# Altium schematic sheet ADF7021 Transceiver.SchDoc: ADF7021 Transceiver
size Letter; SheetNumber: 2; SheetTotal: 11
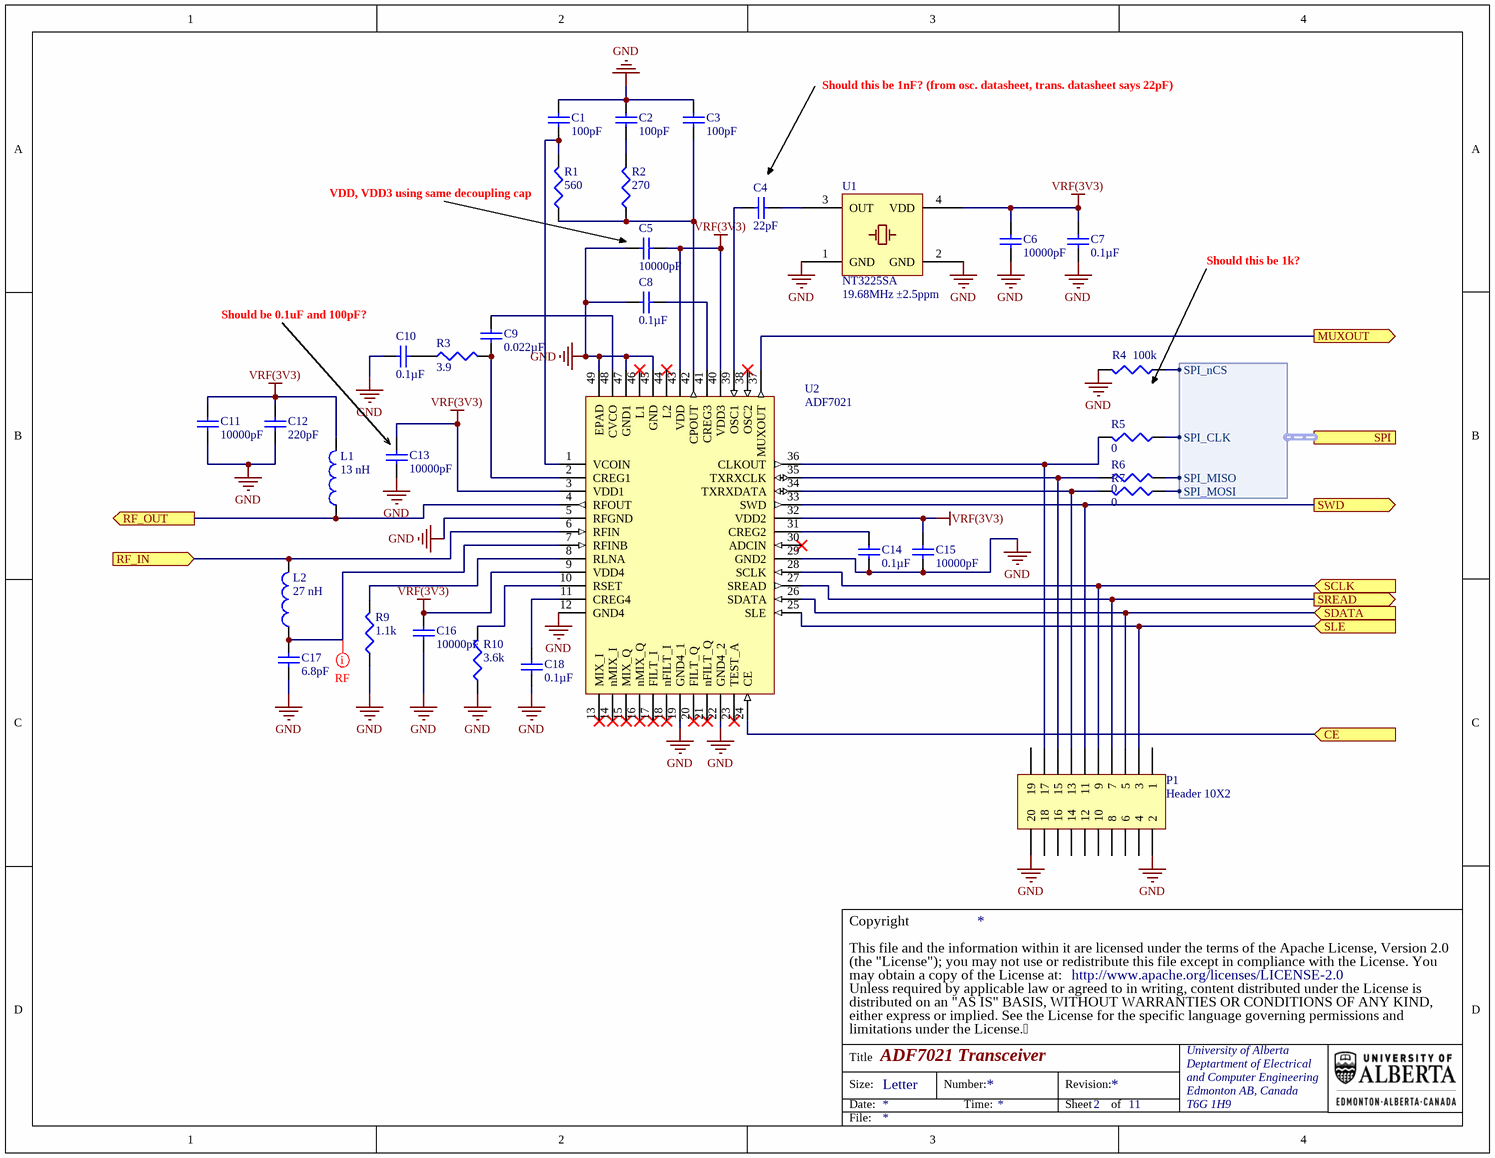
[diagram p0: ADF7021 Transceiver.SchDoc]

## Parts
C1  value 100pF  [TDK-CGA2B]  (hidden comment: Cap)
C2  value 100pF  [TDK-CGA2B]  (hidden comment: Cap)
C3  value 100pF  [TDK-CGA2B]  (hidden comment: Cap)
C4  value 22pF  [ATC-600L]  (hidden comment: Cap)
C5  value 10000pF  [TDK-CGA2B]  (hidden comment: Cap)
C6  value 10000pF  [TDK-CGA2B]  (hidden comment: Cap)
C7  value 0.1µF  [TDK-CGA2B]  (hidden comment: Cap)
C8  value 0.1µF  [TDK-CGA2B]  (hidden comment: Cap)
C9  value 0.022µF  [TDK-CGA2B]  (hidden comment: Cap)
C10  value 0.1µF  [TDK-CGA2B]  (hidden comment: Cap)
C11  value 10000pF  [TDK-CGA2B]  (hidden comment: Cap)
C12  value 220pF  [TDK-CGA2B]  (hidden comment: Cap)
C13  value 10000pF  [TDK-CGA2B]  (hidden comment: Cap)
C14  value 0.1µF  [TDK-CGA2B]  (hidden comment: Cap)
C15  value 10000pF  [TDK-CGA2B]  (hidden comment: Cap)
C16  value 10000pF  [TDK-CGA2B]  (hidden comment: Cap)
C17  value 6.8pF  [ATC-600L]  (hidden comment: Cap)
C18  value 0.1µF  [TDK-CGA2B]  (hidden comment: Cap)
L1  value 13 nH  [CCI-0402CS]  (hidden comment: 0402CS-13NXJLU)
L2  value 27 nH  [CCI-0402CS]  (hidden comment: 0402CS-27NXJLU)
P1  Header 10X2  [MOLX-0555600207]
R1  value 560  [PANA-ERA2A]  (hidden comment: Res3)
R2  value 270  [PANA-ERA2A]  (hidden comment: Res3)
R3  value 3.9  [VSH-CRCW0402]  (hidden comment: Res3)
R4  value 100k  [PANA-ERJ2R]  (hidden comment: Res3)
R5  value 0  [PANA-ERJ2G]  (hidden comment: Jumper)
R6  value 0  [PANA-ERJ2G]  (hidden comment: Jumper)
R7  value 0  [PANA-ERJ2G]  (hidden comment: Jumper)
R9  value 1.1k  [PANA-ERA2A]  (hidden comment: Res3)
R10  value 3.6k  [PANA-ERA2A]  (hidden comment: Res3)
U1  NT3225SA  value 19.68MHz  Frequency Stability: ±2.5ppm  [NDK-NT3225SA]
U2  ADF7021  [ADI-CP-48-5]

## Ports
CE (in), MUXOUT (out), RF_IN (in), RF_OUT (out), SCLK (in), SDATA (in), SLE (in), SPI (harness ADF7021_SPI), SREAD (out), SWD (out)

## Harnesses
ADF7021_SPI: SPI_MOSI, SPI_MISO, SPI_nCS, SPI_CLK

## Nets
GND: C1.2 C2.2 C3.2 C5.1 C6.1 C7.1 C8.2 C10.2 C11.1 C12.1 C13.1 C14.2 C15.1 C16.1 C17.1 C18.2 P1.2 P1.20 R4.2 R9.1 R10.1 U1.1(GND) U1.2(GND) U2.5(RFGND) U2.12(GND4) U2.19(GND4_1) U2.22(GND4_2) U2.29(GND2) U2.45(GND) U2.47(GND1) U2.49(EPAD)
VRF(3V3): C5.2 C6.2 C7.2 C11.2 C12.2 C13.2 C15.2 C16.2 L1.2 U1.4(VDD) U2.3(VDD1) U2.9(VDD4) U2.32(VDD2) U2.40(VDD3) U2.43(VDD)
CE: U2.24(CE) ; port CE
MUXOUT: U2.37(MUXOUT) ; port MUXOUT
RF_IN: L2.2 U2.6(RFIN) ; port RF_IN
RF_OUT: L1.1 U2.4(RFOUT) ; port RF_OUT
SCLK: P1.9 U2.28(SCLK) ; port SCLK
SDATA: P1.5 U2.26(SDATA) ; port SDATA
SLE: P1.3 U2.25(SLE) ; port SLE
SREAD: P1.7 U2.27(SREAD) ; port SREAD
SWD: P1.11 U2.33(SWD) ; port SWD
NetC1_1: C1.1 R1.2 U2.1(VCOIN)
NetC2_1: C2.1 R2.2
NetC3_1: C3.1 R1.1 R2.1 U2.42(CPOUT)
NetC4_1: C4.1 U2.39(OSC1)
NetC4_2: C4.2 U1.3(OUT)
NetC8_1: C8.1 U2.41(CREG3)
NetC9_1: C9.1 R3.2 U2.2(CREG1)
NetC9_2: C9.2 U2.48(CVCO)
NetC10_1: C10.1 R3.1
NetC14_1: C14.1 U2.31(CREG2)
NetC17_2: C17.2 L2.1 U2.7(RFINB)
NetC18_1: C18.1 U2.11(CREG4)
NetP1_13: P1.13 R7.2 U2.34(TXRXDATA)
NetP1_15: P1.15 R6.1 U2.35(TXRXCLK)
NetP1_17: P1.17 R5.2 U2.36(CLKOUT)
NetR4_1: R4.1 ; port SPI.SPI_nCS
NetR5_1: R5.1 ; port SPI.SPI_CLK
NetR6_2: R6.2 ; port SPI.SPI_MISO
NetR7_1: R7.1 ; port SPI.SPI_MOSI
NetR9_2: R9.2 U2.8(RLNA)
NetR10_2: R10.2 U2.10(RSET)

Not connected (* = marked no-connect by the designer): P1 1 4 6 8 10 12 14 16 18 19; U2 13(MIX_I)* 14(nMIX_I)* 15(MIX_Q)* 16(nMIX_Q)* 17(FILT_I)* 18(nFILT_I)* 20(FILT_Q)* 21(nFILT_Q)* 23(TEST_A)* 30(ADCIN)* 38(OSC2)* 44(L2)* 46(L1)*

## Layout directives
net class RF; rule Impedance Constraint [Min = 50.00    Max = 50.00    ]: NetC17_2

## Notes on the sheet
- Should this be 1nF? (from osc. datasheet, trans. datasheet says 22pF)
- (near R1) VDD, VDD3 using same decoupling cap
- Should this be 1k?
- (near C10) Should be 0.1uF and 100pF?
- (the "License"); you may not use or redistribute this file except in compliance with the License. You
- This file and the information within it are licensed under the terms of the Apache License, Version 2.0
- Copyright
- Unless required by applicable law or agreed to in writing, content distributed under the License is
- distributed on an "AS IS" BASIS, WITHOUT WARRANTIES OR CONDITIONS OF ANY KIND,
- either express or implied. See the License for the specific language governing permissions and
- limitations under the License.
- may obtain a copy of the License at:
- http://www.apache.org/licenses/LICENSE-2.0
- Title
- Size:
- Date:
- Letter
- Number:
- Time:
- Revision:
- Sheet
- of
- University of Alberta
- Deptartment of Electrical
- and Computer Engineering
- Edmonton AB, Canada
- T6G 1H9
- File:

## Library data of the parts
C1-C3 = PC-TDK-01226: CAP CER 100PF 100V C0G 0402; Manufacturer Part Number: CGA2B2C0G2A101J050BA; Index: 1226; Designator: C?; Tolerance: ±5%; Temperature Coefficient: NP0; Published: 2016-03-16; LatestRevisionDate: 2016-03-16; LatestRevisionNote: ...; PackageReference: 0402 (1005 Metric); Publisher: AlbertaSat; PackageDescription: Radial Cap, Thru-Hole; 2 Leads; 0.3 in Pin Spacing; Part Number: PC-TDK-01226; Supplier Part Number 1: 445-15510-1-ND; Supplier 1: Digi-key; Supplier Link: http://www.digikey.ca/product-search/en?keywords=445-15510-1-ND; Voltage - Rated: 100V; Applications: Automotive
C4 = PC-ATC-00281: CAP CER 22PF 200V C0G/NP0 0402; Manufacturer Part Number: 600L220FT200T; Index: 281; Designator: C?; Tolerance: ±1%; Temperature Coefficient: C0G, NP0; Published: 2018-08-29; LatestRevisionDate: 2018-08-29; LatestRevisionNote: ...; PackageReference: 0402 (1005 Metric); Publisher: AlbertaSat; PackageDescription: Chip Capacitor, 2-Leads, Body 1.02x0.51mm, IPC Low Density; Part Number: PC-ATC-00281; Supplier Part Number 1: 1284-1114-1-ND; Supplier 1: Digi-key; Supplier Link: https://www.digikey.ca/products/en?keywords=1284-1114-1-ND; Voltage - Rated: 200V; Applications: High Q, Low Loss, Ultra Low ESR
C5 C6 C11 C13 C15 C16 = PC-TDK-01877: CAP CER 10000PF 50V X8R 0402; Manufacturer Part Number: CGA2B3X8R1H103K050BB; Index: 1877; Designator: C?; Tolerance: ±10%; Published: 2016-03-16; LatestRevisionDate: 2016-03-16; LatestRevisionNote: ...; PackageReference: 0402 (1005 Metric); Publisher: AlbertaSat; PackageDescription: Radial Cap, Thru-Hole; 2 Leads; 0.3 in Pin Spacing; Part Number: PC-TDK-01877; Supplier Part Number 1: 445-12303-1-ND; Supplier 1: Digi-key; Supplier Link: http://www.digikey.ca/product-search/en?keywords=445-12303-1-ND; Voltage - Rated: 50V; Temperature Coefficient: X8R; Applications: Automotive
C7 C8 C10 C14 C18 = PC-TDK-02259: CAP CER 0.1UF 50V X7R 0402; Manufacturer Part Number: CGA2B3X7R1H104K050BB; Index: 2259; Designator: C?; Tolerance: ±10%; Published: 2016-03-16; LatestRevisionDate: 2016-03-16; LatestRevisionNote: ...; PackageReference: 0402 (1005 Metric); Publisher: AlbertaSat; PackageDescription: Radial Cap, Thru-Hole; 2 Leads; 0.3 in Pin Spacing; Part Number: PC-TDK-02259; Supplier Part Number 1: 445-6899-1-ND; Supplier 1: Digi-key; Supplier Link: http://www.digikey.ca/product-search/en?keywords=445-6899-1-ND; Voltage - Rated: 50V; Temperature Coefficient: X7R; Applications: Automotive
C9 = PC-TDK-01998: CAP CER 0.022UF 50V X7R 0402; Manufacturer Part Number: CGA2B3X7R1H223K050BB; Index: 1998; Designator: C?; Tolerance: ±10%; Published: 2016-03-16; LatestRevisionDate: 2016-03-16; LatestRevisionNote: ...; PackageReference: 0402 (1005 Metric); Publisher: AlbertaSat; PackageDescription: Radial Cap, Thru-Hole; 2 Leads; 0.3 in Pin Spacing; Part Number: PC-TDK-01998; Supplier Part Number 1: 445-6895-1-ND; Supplier 1: Digi-key; Supplier Link: http://www.digikey.ca/product-search/en?keywords=445-6895-1-ND; Voltage - Rated: 50V; Temperature Coefficient: X7R; Applications: Automotive
C12 = PC-TDK-01303: CAP CER 220PF 50V NP0 0402; Manufacturer Part Number: CGA2B2NP01H221J050BA; Index: 1303; Designator: C?; Tolerance: ±5%; Published: 2016-03-16; LatestRevisionDate: 2016-03-16; LatestRevisionNote: ...; PackageReference: 0402 (1005 Metric); Publisher: AlbertaSat; PackageDescription: Radial Cap, Thru-Hole; 2 Leads; 0.3 in Pin Spacing; Part Number: PC-TDK-01303; Supplier Part Number 1: 445-12129-1-ND; Supplier 1: Digi-key; Supplier Link: http://www.digikey.ca/product-search/en?keywords=445-12129-1-ND; Voltage - Rated: 50V; Temperature Coefficient: NP0; Applications: Automotive
C17 = PC-ATC-00200: CAP CER 6.8PF 200V C0G/NP0 0402; Manufacturer Part Number: 600L6R8BT200T; Index: 200; Designator: C?; Tolerance: ±0.1pF; Temperature Coefficient: C0G, NP0; Published: 2018-08-29; LatestRevisionDate: 2018-08-29; LatestRevisionNote: ...; PackageReference: 0402 (1005 Metric); Publisher: AlbertaSat; PackageDescription: Chip Capacitor, 2-Leads, Body 1.02x0.51mm, IPC Low Density; Part Number: PC-ATC-00200; Supplier Part Number 1: 1284-1134-1-ND; Supplier 1: Digi-key; Supplier Link: https://www.digikey.ca/products/en?keywords=1284-1134-1-ND; Voltage - Rated: 200V; Applications: High Q, Low Loss, Ultra Low ESR
L1 = PL-CCI-00008: Fixed Inductors 0402CS AEC-Q200 13 nH 5 % 0.44 A; Code_IEC: 1005; Index: 8; Designator: L?; Published: 2018-06-17; LatestRevisionDate: 2018-06-17; LatestRevisionNote: ...; PackageReference: 0402 (1005 Metric); Publisher: AlbertaSat; PackageDescription: Chip Inductor, 2-Leads, Body 1.02x0.51mm, IPC Low Density; Code_JEITA: 0402; Part Number: PL-CCI-00008; Manufacturer Part Number: 0402CS-13NXJLU; Supplier Part Number 1: 994-0402CS-13NXJLU; Supplier 1: Mouser; Supplier Part Number 2: 0402CS-13NXJLU; Supplier 2: Coilcraft Direct; Supplier Link: #https://www.mouser.ca/ProductDetail/Coilcraft/0402CS-13NXJLU?qs=sGAEpiMZZMsg%252by3WlYCkU2kWFds1hA9D8Sdb1F7tpJw=#
L2 = PL-CCI-00009: Fixed Inductors 0402CS AEC-Q200 27 nH 5 % 0.4 A / Fixed Inductors 0402CS AEC-Q200 27 nH 5 % 0.4 A; Code_IEC: 1005; Index: 9; Designator: L?; Published: 2018-06-17; LatestRevisionDate: 2018-06-17; LatestRevisionNote: ...; PackageReference: 0402 (1005 Metric); Publisher: AlbertaSat; PackageDescription: Chip Inductor, 2-Leads, Body 1.02x0.51mm, IPC Low Density; Code_JEITA: 0402; Part Number: PL-CCI-00009; Manufacturer Part Number: 0402CS-27NXJLU; Supplier Part Number 1: 994-0402CS-27NXJLU; Supplier 1: Mouser; Supplier Part Number 2: 0402CS-27NXJLU; Supplier 2: Coilcraft Direct; Supplier Link: #https://www.mouser.ca/ProductDetail/Coilcraft/0402CS-27NXJLU?qs=sGAEpiMZZMsg%252by3WlYCkU2kWFds1hA9DQUyEMcwWJWI%3d#
P1 = 50: CONN PLUG 20POS 1.5MM SMD .5MM; Part Number: 50; Manufacturer Part Number: 0555600207; Designator: P?; LatestRevisionDate: 17-Jul-2002; LatestRevisionNote: Re-released for DXP Platform.; Publisher: Altium Limited; Supplier Part Number 1: WM9217CT-ND; Supplier 1: Digi-Key; Supplier Link: #https://www.digikey.ca/product-detail/en/molex-llc/0555600207/WM9217CT-ND/1025137#; PackageReference: MOLX-0555600207
R1 = 15042: RES SMD 560 OHM 0.1% 1/16W 0402; Part Number: 15042; Manufacturer Part Number: ERA-2ARB561X; Designator: R?; Power: 0.063W, 1/16W; Temperature Coefficient: ±10ppm/°C; Published: 8-Jun-2000; LatestRevisionDate: 29-May-2009; LatestRevisionNote: IPC-7351 Footprint Added.; PackageReference: 0402 (1005 Metric); Publisher: Altium Limited; PackageDescription: Chip Resistor, 2-Leads, Body 1.00x0.50mm, IPC Low Density; Supplier Part Number 1: P560CPCT-ND; Supplier 1: Digi-Key; Supplier Link: http://www.digikey.ca/product-search/en?keywords=P560CPCT-ND; Tolerance: ±0.1%
R2 = 14593: RES SMD 270 OHM 0.1% 1/16W 0402; Part Number: 14593; Manufacturer Part Number: ERA-2ARB271X; Designator: R?; Power: 0.063W, 1/16W; Temperature Coefficient: ±10ppm/°C; Published: 8-Jun-2000; LatestRevisionDate: 29-May-2009; LatestRevisionNote: IPC-7351 Footprint Added.; PackageReference: 0402 (1005 Metric); Publisher: Altium Limited; PackageDescription: Chip Resistor, 2-Leads, Body 1.00x0.50mm, IPC Low Density; Supplier Part Number 1: P270CPCT-ND; Supplier 1: Digi-Key; Supplier Link: http://www.digikey.ca/product-search/en?keywords=P270CPCT-ND; Tolerance: ±0.1%
R3 = PR-VSH-00269: RES SMD 3.9 OHM 1% 1/16W 0402; Manufacturer Part Number: CRCW04023R90FKED; Index: 269; Designator: R?; Power - Rated: 0.063W; Temperature Coefficient: ±100ppm/°C; Published: 2018-12-11; LatestRevisionDate: 2018-12-11; LatestRevisionNote: ...; PackageReference: 0402 (1005 Metric); Publisher: AlbertaSat; PackageDescription: Chip Resistor, 2-Leads, Body 1.00x0.50mm, IPC Low Density; Part Number: PR-VSH-00269; Supplier Part Number 1: 541-3.90LLCT-ND; Supplier 1: Digi-key; Supplier Part Number 2: 71-CRCW04023R90FKED; Supplier 2: Mouser; Supplier Link: #https://www.digikey.ca/product-detail/en/vishay-dale/CRCW04023R90FKED/541-3.90LLCT-ND/1961949#; Tolerance: ±1%; Applications: Automotive
R4 = 18739: RES SMD 100K OHM 1% 1/10W 0402; Part Number: 18739; Manufacturer Part Number: ERJ-2RKF1003X; Designator: R?; Power: 0.1W, 1/10W; Temperature Coefficient: ±100ppm/°C; Published: 8-Jun-2000; LatestRevisionDate: 29-May-2009; LatestRevisionNote: IPC-7351 Footprint Added.; PackageReference: 0402 (1005 Metric); Publisher: Altium Limited; PackageDescription: Chip Resistor, 2-Leads, Body 1.00x0.50mm, IPC Low Density; Supplier Part Number 1: P100KLCT-ND; Supplier 1: Digi-Key; Supplier Link: http://www.digikey.ca/product-search/en?keywords=P100KLCT-ND; Tolerance: ±1%
R5-R7 = 13127: RES SMD 0.0OHM JUMPER 1/10W 0402; Part Number: 13127; Manufacturer Part Number: ERJ-2GE0R00X; Designator: R?; Power: 0.1W, 1/10W; PackageDescription: Chip Resistor, 2-Leads, Body 1.00x0.50mm, IPC Low Density; Supplier Part Number 1: P0.0JCT-ND; Supplier 1: Digi-Key; Supplier Link: http://www.digikey.ca/product-search/en?keywords=P0.0JCT-ND; PackageReference: 0402 (1005 Metric); Tolerance: Jumper; Temperature Coefficient: -; Type: Jumper
R9 = 15460: RES SMD 1.1K OHM 0.1% 1/16W 0402; Part Number: 15460; Manufacturer Part Number: ERA-2ARB112X; Designator: R?; Power: 0.063W, 1/16W; Temperature Coefficient: ±10ppm/°C; Published: 8-Jun-2000; LatestRevisionDate: 29-May-2009; LatestRevisionNote: IPC-7351 Footprint Added.; PackageReference: 0402 (1005 Metric); Publisher: Altium Limited; PackageDescription: Chip Resistor, 2-Leads, Body 1.00x0.50mm, IPC Low Density; Supplier Part Number 1: P1.1KCPCT-ND; Supplier 1: Digi-Key; Supplier Link: http://www.digikey.ca/product-search/en?keywords=P1.1KCPCT-ND; Tolerance: ±0.1%
R10 = 16432: RES SMD 3.6K OHM 0.1% 1/16W 0402; Part Number: 16432; Manufacturer Part Number: ERA-2ARB362X; Designator: R?; Power: 0.063W, 1/16W; Temperature Coefficient: ±10ppm/°C; Published: 8-Jun-2000; LatestRevisionDate: 29-May-2009; LatestRevisionNote: IPC-7351 Footprint Added.; PackageReference: 0402 (1005 Metric); Publisher: Altium Limited; PackageDescription: Chip Resistor, 2-Leads, Body 1.00x0.50mm, IPC Low Density; Supplier Part Number 1: P3.6KCPCT-ND; Supplier 1: Digi-Key; Supplier Link: http://www.digikey.ca/product-search/en?keywords=P3.6KCPCT-ND; Tolerance: ±0.1%
U1 = PU-NDK-00001: OSC VCTCXO 19.68MHZ SMD; Manufacturer Part Number: NT3225SA-19.680000MHZ; Index: 1; Designator: U?; Voltage - Supply: 3V; Current - Supply (Max): 1.5mA; Part Number: PU-NDK-00001; Supplier Part Number 1: 644-1088-1-ND; Supplier 1: Digi-key; Supplier Part Number 2: NT3225SA-19.680000MHZ; Supplier 2: Excess Parts; Publisher: AlbertaSat; Published: 2018-09-04; LatestRevisionDate: 2018-09-04; LatestRevisionNote: ...; PackageReference: 4-SMD, No Lead; PackageDescription: 4-SMD, No Lead, 0.126" L x 0.098" W x 0.039" H (3.20mm x 2.50mm x 1.00mm); Supplier Link: #https://www.digikey.ca/products/en?keywords=644-1088-1-ND#; Operating Temperature: -30°C ~ 75°C
U2 = PU-ADI-00005: IC RF TXRX ISM<1GHZ 48-VFQFN; Manufacturer_Name: Analog Devices; Manufacturer Part Number: ADF7021BCPZ-RL; Geometry.Height: 0.8mm; Index: 5; Designator: U?; Supplier_Name: RS; RS Part Number: 6977565; Manufacturer_Part_Number: ADF7021BCPZ; Allied_Number: *; Other Part Number: *; Datasheet Link: http://www.analog.com/static/imported-files/data_sheets/ADF7021.pdf; 3D Package: *; Part Number: PU-ADI-00005; Supplier Part Number 1: ADF7021BCPZ-RLCT-ND; Supplier 1: Digi-key; Supplier Part Number 2: 584-ADF7021BCPZ-R; Supplier 2: Mouser; Publisher: AlbertaSat; Published: 2018-02-06; LatestRevisionDate: 2018-02-06; LatestRevisionNote: ...; PackageReference: 48-VFQFN; PackageDescription: PQFN, 48-Leads, Body 7.00x7.00mm, Pitch 0.50mm, Thermal Pad 4.10x4.10mm, IPC Medium Density; Supplier Link: #https://www.digikey.ca/product-detail/en/analog-devices-inc/ADF7021BCPZ-RL/ADF7021BCPZ-RLCT-ND/4162134#